# Altium project RaspberryPi3BP-Layout.PrjPcb
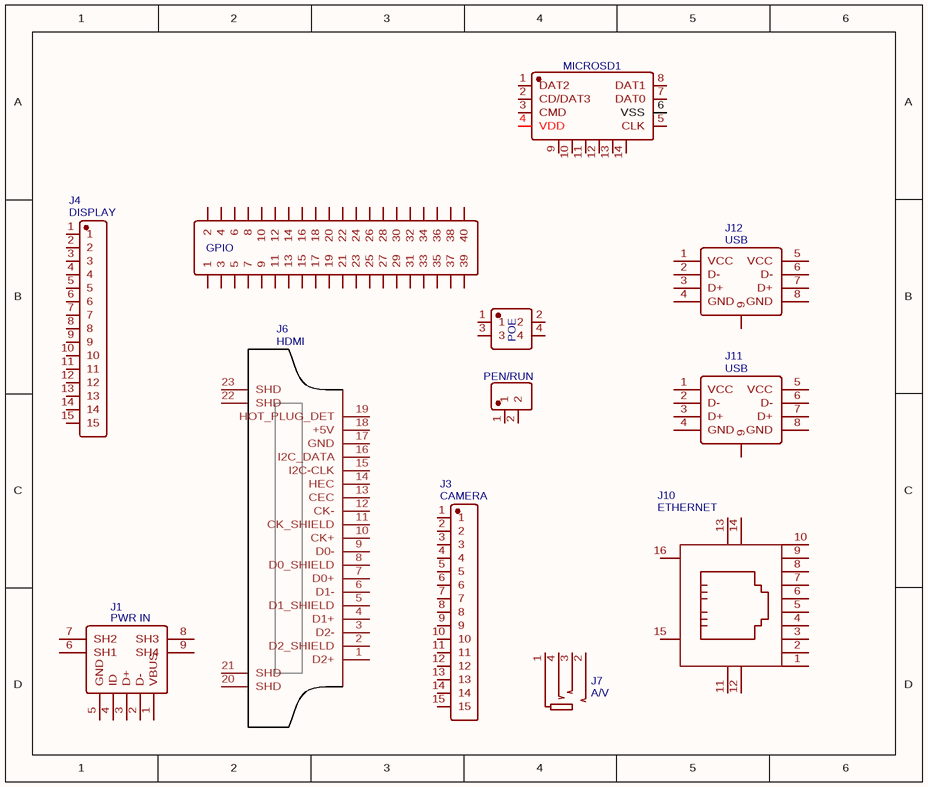
[diagram p0: RaspberryPi3BP-Layout.schdoc]
1 sheet, 12 parts. Net scope: global (net labels, ports and power ports of the same name join across sheets).
Board file: RaspberryPi3BP-Layout.pcbdoc

## Sheet RaspberryPi3BP-Layout.schdoc
size 172 x 146 mm

### Parts
GPIO  Header-Male-2.54_2x20  [HDR-TH_40P-P2.54-V-M-R2-C20-S2.54]  (value not drawn)
J1  PWR IN  [MICRO-USB-SMD_MICROXNJ]
J3  CAMERA  [FPC-SMD_15P-P1.00_HDGC_1.0K-GT-15PB]
J4  DISPLAY  [FPC-SMD_15P-P1.00_HDGC_1.0K-GT-15PB]
J6  HDMI  [HDMI-SMD_HDMI-019S]
J7  A/V  [AUDIO-TH_HOOYA_PJ-322]
J10  ETHERNET  [RJ45-TH_XKB_X01AQ068DB2AD]
J11  USB  [USB-A-TH_U-USBAR04P-F201]
J12  USB  [USB-A-TH_U-USBAR04P-F201]
MICROSD1  1040310811  [MICROSD/TF]  (value not drawn)
PEN/RUN  KH-2.54PH180-1X2P-L11.5  [HDR-TH_2P-P2.54-V-M]  (value not drawn)
POE  210-72-02GB01  [HDR-TH_4P-P2.54-V-R2-C2-S2.54_A2541WV-2X2P]  (value not drawn)

### Nets

Not connected (* = marked no-connect by the designer): GPIO 1 2 3 4 5 6 7 8 9 10 11 12 13 14 15 16 17 18 19 20 21 22 23 24 25 26 27 28 29 30 31 32 33 34 35 36 37 38 39 40; J1 1(VBUS) 2(D-) 3(D+) 4(ID) 5(GND) 6(SH1) 7(SH2) 8(SH3) 9(SH4); J3 1 2 3 4 5 6 7 8 9 10 11 12 13 14 15; J4 1 2 3 4 5 6 7 8 9 10 11 12 13 14 15; J6 1(D2+) 2(D2_SHIELD) 3(D2-) 4(D1+) 5(D1_SHIELD) 6(D1-) 7(D0+) 8(D0_SHIELD) 9(D0-) 10(CK+) 11(CK_SHIELD) 12(CK-) 13(CEC) 14(HEC) 15(I2C-CLK) 16(I2C_DATA) 17(GND) 18(+5V) 19(HOT_PLUG_DET) 20(SHD) 21(SHD) 22(SHD) 23(SHD); J7 1 2 3 4; J10 1 2 3 4 5 6 7 8 9 10 11(LED-L+) 12(LED-L-) 13(LED-R-) 14(LED-R+) 15(SHELL) 16(SHELL); J11 1(VCC) 2(D-) 3(D+) 4(GND) 5(VCC) 6(D-) 7(D+) 8(GND) 9; J12 1(VCC) 2(D-) 3(D+) 4(GND) 5(VCC) 6(D-) 7(D+) 8(GND) 9; MICROSD1 1(DAT2) 2(CD/DAT3) 3(CMD) 4(VDD) 5(CLK) 6(VSS) 7(DAT0) 8(DAT1) 9 10 11 12 13 14; PEN/RUN 1 2; POE 1 2 3 4

### Library data of the parts
GPIO = Header-Male-2.54_2x20: BOM_Manufacturer: ReliaPro; BOM_Supplier: LCSC; BOM_Manufacturer Part: Header-Male-2.54_2x20; BOM_Supplier Part: C50980; BOM_JLCPCB Part Class: Extended Part; spicePre: H; spiceSymbolName: Header-Male-2.54_2x20
J1 = PWR IN: BOM_Manufacturer: SHOU HAN; BOM_Manufacturer Part: MicroXNJ; Contributor: LCSC; BOM_Supplier: LCSC; BOM_Supplier Part: C404969; BOM_JLCPCB Part Class: Extended Part; spicePre: U; spiceSymbolName: MICROXNJ
J3 = CAMERA: BOM_Manufacturer: HDGC(华德共创); BOM_Manufacturer Part: 1.0K-GT-15PB; Contributor: LCSC; BOM_Supplier: LCSC; BOM_Supplier Part: C2915527; BOM_JLCPCB Part Class: Extended Part; spicePre: F; spiceSymbolName: 1.0K-GT-15PB
J4 = DISPLAY: BOM_Manufacturer: HDGC(华德共创); BOM_Manufacturer Part: 1.0K-GT-15PB; Contributor: LCSC; BOM_Supplier: LCSC; BOM_Supplier Part: C2915527; BOM_JLCPCB Part Class: Extended Part; spicePre: F; spiceSymbolName: 1.0K-GT-15PB
J6 = HDMI: BOM_Manufacturer: SOFNG; BOM_Manufacturer Part: HDMI-019S; BOM_Supplier: LCSC; BOM_Supplier Part: C111617; BOM_JLCPCB Part Class: Extended Part; spicePre: H; spiceSymbolName: HDMI-019S
J7 = A/V: BOM_Manufacturer: HOOYA(香港皓宇); BOM_Manufacturer Part: PJ-322; Contributor: LCSC; BOM_Supplier: LCSC; BOM_Supplier Part: C2939185; BOM_JLCPCB Part Class: Extended Part; spicePre: C; spiceSymbolName: PJ-322
J10 = ETHERNET: BOM_Manufacturer: XKB Connectivity(中国星坤); BOM_Manufacturer Part: X01AQ038AB2AD; Contributor: LCSC; BOM_Supplier: LCSC; BOM_Supplier Part: C2916474; spicePre: R; spiceSymbolName: X01AQ038AB2AD
J11 J12 = USB: BOM_Manufacturer: Shenzhen Cankemeng; BOM_Manufacturer Part: U-USBAR04P-F201; Contributor: LCSC; BOM_Supplier: LCSC; BOM_Supplier Part: C386741; BOM_JLCPCB Part Class: Extended Part; spicePre: U; spiceSymbolName: U-USBAR04P-F201
MICROSD1 = 1040310811: BOM_Manufacturer: MOLEX; Contributor: LCSC; BOM_Supplier: LCSC; BOM_Supplier Part: C585350; BOM_Manufacturer Part: 1040310811; BOM_JLCPCB Part Class: Extended Part; spicePre: S; spiceSymbolName: 1040310811
PEN/RUN = KH-2.54PH180-1X2P-L11.5: BOM_Manufacturer: kinghelm(金航标); Contributor: LCSC; BOM_Supplier: LCSC; BOM_Supplier Part: C2905434; BOM_Manufacturer Part: KH-2.54PH180-1X2P-L11.5; BOM_JLCPCB Part Class: Extended Part; spicePre: H; spiceSymbolName: KH-2.54PH180-1X2P-L11.5
POE = 210-72-02GB01: BOM_Manufacturer: PINREX; Contributor: LCSC; BOM_Supplier: LCSC; BOM_Supplier Part: C402780; BOM_Manufacturer Part: 210-72-02GB01; BOM_JLCPCB Part Class: Extended Part; spicePre: H; spiceSymbolName: 210-72-02GB01